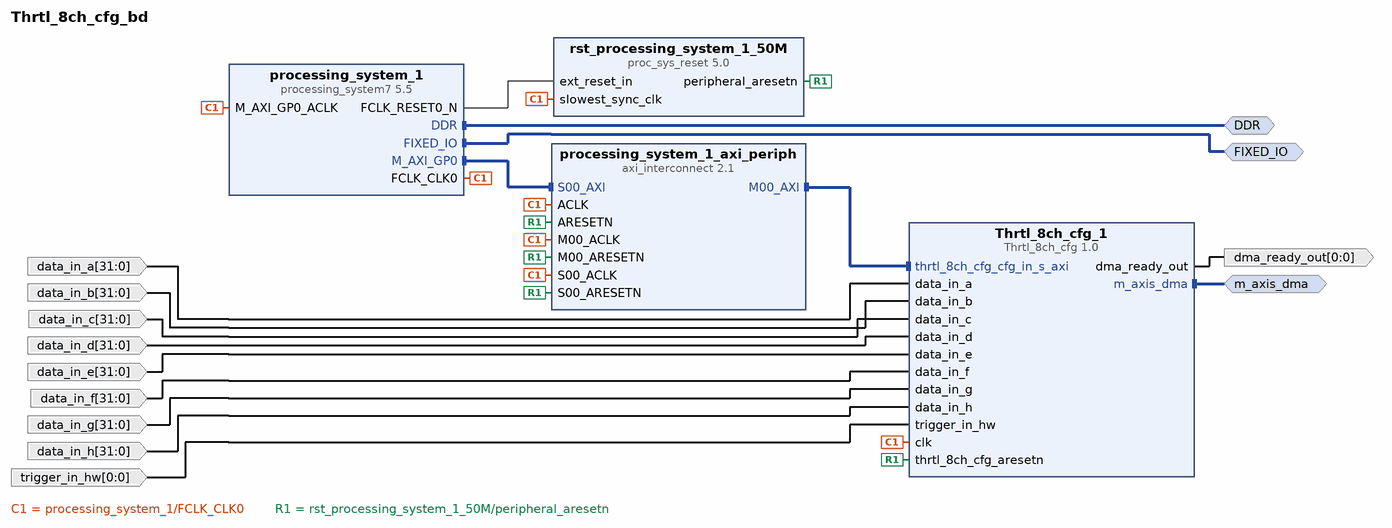
[diagram p0: block diagram of the top level]
# Vivado block design Thrtl_8ch_cfg_bd, xc7z020clg400-1, Vivado 2024.2
create_bd_design Thrtl_8ch_cfg_bd

create_bd_intf_port -mode Master -vlnv xilinx.com:interface:ddrx_rtl:1.0 DDR
create_bd_intf_port -mode Master -vlnv xilinx.com:display_processing_system7:fixedio_rtl:1.0 FIXED_IO
create_bd_intf_port -mode Master -vlnv xilinx.com:interface:axis_rtl:1.0 m_axis_dma
set_property -dict {CONFIG.FREQ_HZ 50000000} [get_bd_intf_ports m_axis_dma]
create_bd_port -dir I -from 31 -to 0 -type data data_in_a
create_bd_port -dir I -from 31 -to 0 -type data data_in_b
create_bd_port -dir I -from 31 -to 0 -type data data_in_c
create_bd_port -dir I -from 31 -to 0 -type data data_in_d
create_bd_port -dir I -from 31 -to 0 -type data data_in_e
create_bd_port -dir I -from 31 -to 0 -type data data_in_f
create_bd_port -dir I -from 31 -to 0 -type data data_in_g
create_bd_port -dir I -from 31 -to 0 -type data data_in_h
create_bd_port -dir O -from 0 -to 0 -type data dma_ready_out
create_bd_port -dir I -from 0 -to 0 -type data trigger_in_hw

create_bd_cell -type ip -vlnv User_Company:VMC:Thrtl_8ch_cfg:1.0 Thrtl_8ch_cfg_1
create_bd_cell -type ip -vlnv xilinx.com:ip:processing_system7:5.5 processing_system_1
# 33 more settings of processing_system_1 are not shown: defaults, MIO pin electricals, DDR timing, and values the tool derives
create_bd_cell -type ip -vlnv xilinx.com:ip:axi_interconnect:2.1 processing_system_1_axi_periph
set_property -dict {CONFIG.NUM_MI 1} [get_bd_cells processing_system_1_axi_periph]
create_bd_cell -type ip -vlnv xilinx.com:ip:proc_sys_reset:5.0 rst_processing_system_1_50M

# ---- connections ----

connect_bd_intf_net [get_bd_intf_pins Thrtl_8ch_cfg_1/m_axis_dma] [get_bd_intf_ports m_axis_dma]
connect_bd_intf_net [get_bd_intf_ports DDR] [get_bd_intf_pins processing_system_1/DDR]
connect_bd_intf_net [get_bd_intf_ports FIXED_IO] [get_bd_intf_pins processing_system_1/FIXED_IO]
connect_bd_intf_net [get_bd_intf_pins processing_system_1/M_AXI_GP0] [get_bd_intf_pins processing_system_1_axi_periph/S00_AXI]
connect_bd_intf_net [get_bd_intf_pins processing_system_1_axi_periph/M00_AXI] [get_bd_intf_pins Thrtl_8ch_cfg_1/thrtl_8ch_cfg_cfg_in_s_axi]
connect_bd_net [get_bd_pins Thrtl_8ch_cfg_1/dma_ready_out] [get_bd_ports dma_ready_out]
connect_bd_net [get_bd_ports data_in_a] [get_bd_pins Thrtl_8ch_cfg_1/data_in_a]
connect_bd_net [get_bd_ports data_in_b] [get_bd_pins Thrtl_8ch_cfg_1/data_in_b]
connect_bd_net [get_bd_ports data_in_c] [get_bd_pins Thrtl_8ch_cfg_1/data_in_c]
connect_bd_net [get_bd_ports data_in_d] [get_bd_pins Thrtl_8ch_cfg_1/data_in_d]
connect_bd_net [get_bd_ports data_in_e] [get_bd_pins Thrtl_8ch_cfg_1/data_in_e]
connect_bd_net [get_bd_ports data_in_f] [get_bd_pins Thrtl_8ch_cfg_1/data_in_f]
connect_bd_net [get_bd_ports data_in_g] [get_bd_pins Thrtl_8ch_cfg_1/data_in_g]
connect_bd_net [get_bd_ports data_in_h] [get_bd_pins Thrtl_8ch_cfg_1/data_in_h]
connect_bd_net [get_bd_pins processing_system_1/FCLK_CLK0] \
  [get_bd_pins processing_system_1/M_AXI_GP0_ACLK] [get_bd_pins processing_system_1_axi_periph/S00_ACLK] \
  [get_bd_pins rst_processing_system_1_50M/slowest_sync_clk] [get_bd_pins Thrtl_8ch_cfg_1/clk] \
  [get_bd_pins processing_system_1_axi_periph/M00_ACLK] [get_bd_pins processing_system_1_axi_periph/ACLK]
connect_bd_net [get_bd_pins processing_system_1/FCLK_RESET0_N] [get_bd_pins rst_processing_system_1_50M/ext_reset_in]
connect_bd_net [get_bd_pins rst_processing_system_1_50M/peripheral_aresetn] \
  [get_bd_pins processing_system_1_axi_periph/S00_ARESETN] [get_bd_pins Thrtl_8ch_cfg_1/thrtl_8ch_cfg_aresetn] \
  [get_bd_pins processing_system_1_axi_periph/M00_ARESETN] [get_bd_pins processing_system_1_axi_periph/ARESETN]
connect_bd_net [get_bd_ports trigger_in_hw] [get_bd_pins Thrtl_8ch_cfg_1/trigger_in_hw]

# ---- address map ----
assign_bd_address -offset 0x40000000 -range 4K -target_address_space [get_bd_addr_spaces processing_system_1/Data] [get_bd_addr_segs Thrtl_8ch_cfg_1/thrtl_8ch_cfg_cfg_in_s_axi/reg0]

validate_bd_design
save_bd_design
